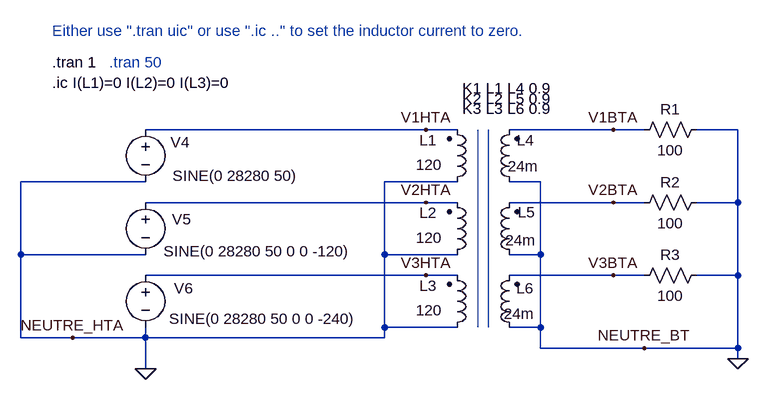
[diagram p0: schematic TRANSFORMER TRI_1.asc]
TRANSFORMER TRI_1.asc, the LTspice schematic file:
Version 4
SHEET 1 880 680
WIRE 288 224 -144 224
WIRE 336 224 288 224
WIRE 576 224 416 224
WIRE 624 224 576 224
WIRE 768 224 704 224
WIRE -144 304 -336 304
WIRE 336 304 224 304
WIRE 464 304 416 304
WIRE 288 336 -144 336
WIRE 336 336 288 336
WIRE 576 336 416 336
WIRE 624 336 576 336
WIRE 768 336 768 224
WIRE 768 336 704 336
WIRE -336 416 -336 304
WIRE -144 416 -336 416
WIRE 224 416 224 304
WIRE 336 416 224 416
WIRE 464 416 464 304
WIRE 464 416 416 416
WIRE 288 448 -144 448
WIRE 336 448 288 448
WIRE 576 448 416 448
WIRE 624 448 576 448
WIRE 768 448 768 336
WIRE 768 448 704 448
WIRE 224 528 224 416
WIRE 336 528 224 528
WIRE 464 528 464 416
WIRE 464 528 416 528
WIRE -336 544 -336 416
WIRE -256 544 -336 544
WIRE -144 544 -144 528
WIRE -144 544 -256 544
WIRE 224 544 224 528
WIRE 224 544 -144 544
WIRE 464 560 464 528
WIRE 624 560 464 560
WIRE 768 560 768 448
WIRE 768 560 624 560
WIRE 768 576 768 560
WIRE -144 592 -144 544
FLAG -144 592 0
FLAG 288 224 V1HTA
FLAG 288 336 V2HTA
FLAG 288 448 V3HTA
FLAG -256 544 NEUTRE_HTA
FLAG 768 576 0
FLAG 624 560 NEUTRE_BT
FLAG 576 224 V1BTA
FLAG 576 336 V2BTA
FLAG 576 448 V3BTA
SYMBOL ind2 320 320 M180
WINDOW 0 -15 80 Right 0
WINDOW 3 -7 42 Right 0
SYMATTR InstName L1
SYMATTR Value 120
SYMATTR Type ind
SYMATTR SpiceLine Rser=15
SYMBOL ind2 320 432 M180
WINDOW 0 -15 80 Right 0
WINDOW 3 -7 42 Right 0
SYMATTR InstName L2
SYMATTR Value 120
SYMATTR Type ind
SYMATTR SpiceLine Rser=15
SYMBOL ind2 320 544 M180
WINDOW 0 -15 80 Right 0
WINDOW 3 -7 42 Right 0
SYMATTR InstName L3
SYMATTR Value 120
SYMATTR Type ind
SYMATTR SpiceLine Rser=15
SYMBOL ind2 432 320 R180
WINDOW 0 -23 80 Left 0
WINDOW 3 -29 40 Left 0
SYMATTR InstName L4
SYMATTR Value 24m
SYMATTR Type ind
SYMATTR SpiceLine Rser=5
SYMBOL ind2 432 432 R180
WINDOW 0 -24 81 Left 0
WINDOW 3 -25 38 Left 0
SYMATTR InstName L5
SYMATTR Value 24m
SYMATTR Type ind
SYMATTR SpiceLine Rser=5
SYMBOL ind2 432 544 R180
WINDOW 0 -22 76 Left 0
WINDOW 3 -23 37 Left 0
SYMATTR InstName L6
SYMATTR Value 24m
SYMATTR Type ind
SYMATTR SpiceLine Rser=5
SYMBOL res 720 208 R90
WINDOW 0 0 56 VBottom 0
WINDOW 3 32 56 VTop 0
SYMATTR InstName R1
SYMATTR Value 100
SYMBOL res 720 320 R90
WINDOW 0 0 56 VBottom 0
WINDOW 3 32 56 VTop 0
SYMATTR InstName R2
SYMATTR Value 100
SYMBOL res 720 432 R90
WINDOW 0 0 56 VBottom 0
WINDOW 3 32 56 VTop 0
SYMATTR InstName R3
SYMATTR Value 100
SYMBOL voltage -144 208 R0
WINDOW 0 39 35 Left 0
WINDOW 3 42 87 Left 0
SYMATTR InstName V4
SYMATTR Value SINE(0 28280 50)
SYMBOL voltage -144 320 R0
WINDOW 0 41 42 Left 0
WINDOW 3 28 91 Left 0
WINDOW 123 0 0 Left 0
WINDOW 39 0 0 Left 0
SYMATTR InstName V5
SYMATTR Value SINE(0 28280 50 0 0 -120)
SYMBOL voltage -144 432 R0
WINDOW 0 44 36 Left 0
WINDOW 3 36 83 Left 0
WINDOW 123 0 0 Left 0
WINDOW 39 0 0 Left 0
SYMATTR InstName V6
SYMATTR Value SINE(0 28280 50 0 0 -240)
TEXT -288 120 Left 0 !.tran 1
TEXT 344 160 Left 0 !K1 L1 L4 0.9
TEXT 344 176 Left 0 !K2 L2 L5 0.9
TEXT 344 192 Left 0 !K3 L3 L6 0.9
TEXT -288 152 Left 0 !.ic I(L1)=0 I(L2)=0 I(L3)=0
TEXT -200 120 Left 0 ;.tran 50
TEXT -288 72 Left 0 ;Either use ".tran uic" or use ".ic .." to set the inductor current to zero.
LINE Normal 368 528 368 224
LINE Normal 384 528 384 224

The netlist it stands for:
* TRANSFORMER TRI_1.asc
L1 0 V1HTA 120 Rser=15
L2 0 V2HTA 120 Rser=15
L3 0 V3HTA 120 Rser=15
L4 0 V1BTA 24m Rser=5
L5 0 V2BTA 24m Rser=5
L6 0 V3BTA 24m Rser=5
R1 0 V1BTA 100
R2 0 V2BTA 100
R3 0 V3BTA 100
V4 V1HTA 0 SINE(0 28280 50)
V5 V2HTA 0 SINE(0 28280 50 0 0 -120)
V6 V3HTA 0 SINE(0 28280 50 0 0 -240)
.tran 1
K1 L1 L4 0.9
K2 L2 L5 0.9
K3 L3 L6 0.9
.ic I(L1)=0 I(L2)=0 I(L3)=0
* .tran 50
* Either use ".tran uic" or use ".ic .." to set the inductor current to zero.
.backanno
.end